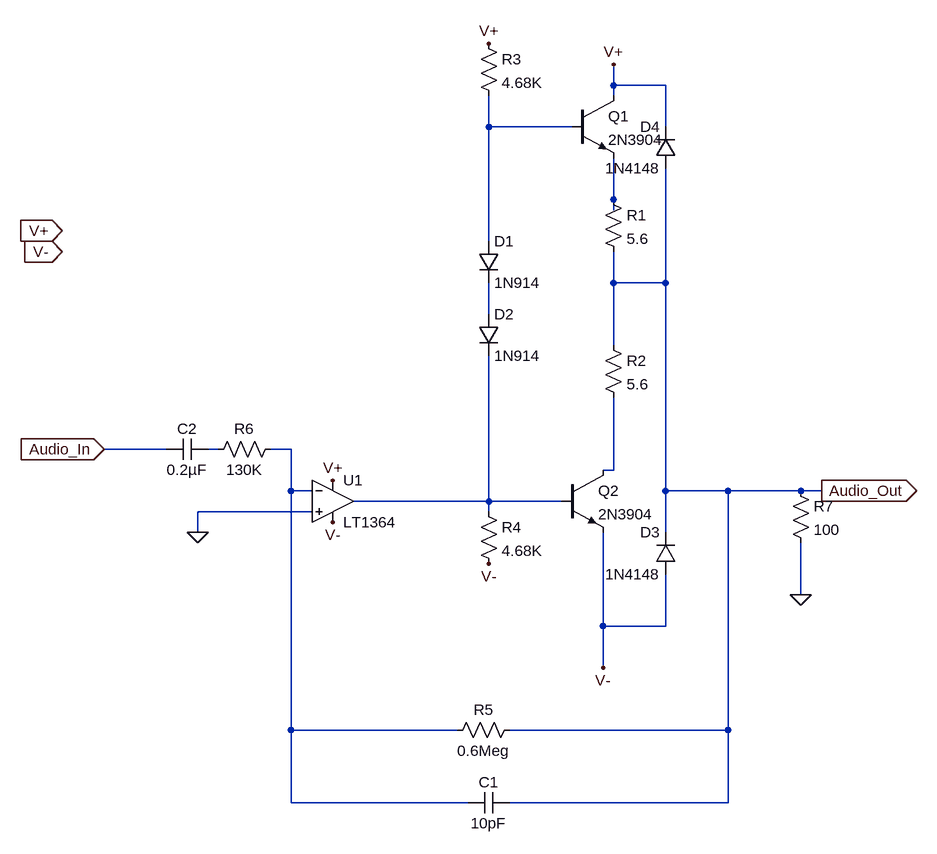
[diagram p0: schematic SpeakerDriver.asc]
SpeakerDriver.asc, the LTspice schematic file:
Version 4
SHEET 1 880 1204
WIRE 336 32 336 0
WIRE 416 32 336 32
WIRE 336 48 336 32
WIRE 144 96 144 48
WIRE 272 96 144 96
WIRE 416 96 416 32
WIRE 336 208 336 144
WIRE 336 224 336 208
WIRE 144 272 144 96
WIRE 336 336 336 288
WIRE 416 336 416 160
WIRE 416 336 336 336
WIRE 144 384 144 336
WIRE 336 432 336 336
WIRE -352 592 -448 592
WIRE -272 592 -288 592
WIRE -160 592 -192 592
WIRE 336 624 336 512
WIRE 336 624 320 624
WIRE -160 656 -160 592
WIRE -128 656 -160 656
WIRE 416 656 416 336
WIRE 512 656 416 656
WIRE 624 656 512 656
WIRE 656 656 624 656
WIRE 144 672 144 448
WIRE 144 672 -64 672
WIRE 256 672 144 672
WIRE -128 688 -304 688
WIRE 144 688 144 672
WIRE -304 720 -304 688
WIRE 416 720 416 656
WIRE 624 816 624 736
WIRE 320 864 320 720
WIRE 416 864 416 784
WIRE 416 864 320 864
WIRE 320 928 320 864
WIRE -160 1024 -160 656
WIRE 96 1024 -160 1024
WIRE 512 1024 512 656
WIRE 512 1024 176 1024
WIRE -160 1136 -160 1024
WIRE 112 1136 -160 1136
WIRE 512 1136 512 1024
WIRE 512 1136 176 1136
FLAG -448 592 Audio_In
IOPIN -448 592 In
FLAG 656 656 Audio_Out
IOPIN 656 656 Out
FLAG -304 720 0
FLAG 624 816 0
FLAG -512 256 V+
IOPIN -512 256 In
FLAG -512 288 V-
IOPIN -512 288 In
FLAG -96 640 V+
FLAG 144 -32 V+
FLAG 336 0 V+
FLAG -96 704 V-
FLAG 144 768 V-
FLAG 320 928 V-
SYMBOL npn 256 624 R0
SYMATTR InstName Q2
SYMATTR Value 2N3904
SYMBOL res 320 192 R0
SYMATTR InstName R1
SYMATTR Value 5.6
SYMBOL res 320 416 R0
SYMATTR InstName R2
SYMATTR Value 5.6
SYMBOL diode 128 272 R0
SYMATTR InstName D1
SYMATTR Value 1N914
SYMBOL diode 128 384 R0
SYMATTR InstName D2
SYMATTR Value 1N914
SYMBOL res 128 -48 R0
SYMATTR InstName R3
SYMATTR Value 4.68K
SYMBOL res 128 672 R0
SYMATTR InstName R4
SYMATTR Value 4.68K
SYMBOL diode 432 784 R180
WINDOW 0 24 64 Left 2
WINDOW 3 24 0 Left 2
SYMATTR InstName D3
SYMATTR Value 1N4148
SYMBOL diode 432 160 R180
WINDOW 0 24 64 Left 2
WINDOW 3 24 0 Left 2
SYMATTR InstName D4
SYMATTR Value 1N4148
SYMBOL npn 272 48 R0
SYMATTR InstName Q1
SYMATTR Value 2N3904
SYMBOL res 192 1008 R90
WINDOW 0 0 56 VBottom 2
WINDOW 3 32 56 VTop 2
SYMATTR InstName R5
SYMATTR Value 0.6Meg
SYMBOL cap 176 1120 R90
WINDOW 0 0 32 VBottom 2
WINDOW 3 32 32 VTop 2
SYMATTR InstName C1
SYMATTR Value 10pF
SYMBOL cap -288 576 R90
WINDOW 0 0 32 VBottom 2
WINDOW 3 32 32 VTop 2
SYMATTR InstName C2
SYMATTR Value 0.2µF
SYMBOL res -176 576 R90
WINDOW 0 0 56 VBottom 2
WINDOW 3 32 56 VTop 2
SYMATTR InstName R6
SYMATTR Value 130K
SYMBOL res 608 640 R0
SYMATTR InstName R7
SYMATTR Value 100
SYMBOL Opamps\\LT1364 -96 608 R0
SYMATTR InstName U1

The netlist it stands for:
* SpeakerDriver.asc
Q2 N006 N007 V- 0 2N3904
R1 N002 Audio_Out 5.6
R2 Audio_Out N006 5.6
D1 N001 N003 1N914
D2 N003 N007 1N914
R3 V+ N001 4.68K
R4 N007 V- 4.68K
D3 V- Audio_Out 1N4148
D4 Audio_Out V+ 1N4148
Q1 V+ N001 N002 0 2N3904
R5 Audio_Out N005 0.6Meg
C1 Audio_Out N005 10pF
C2 N004 Audio_In 0.2µF
R6 N005 N004 130K
R7 Audio_Out 0 100
XU1 0 N005 V+ V- N007 LT1363  ; LT1364, pins In+ In- V+ V- OUT
.model D D
.lib standard.dio
.model NPN NPN
.model PNP PNP
.lib standard.bjt
.lib LTC.lib
.backanno
.end